# Altium project PPC_notebook_electrical_schematics_v0.6.PrjPcb (part 10 of 10)
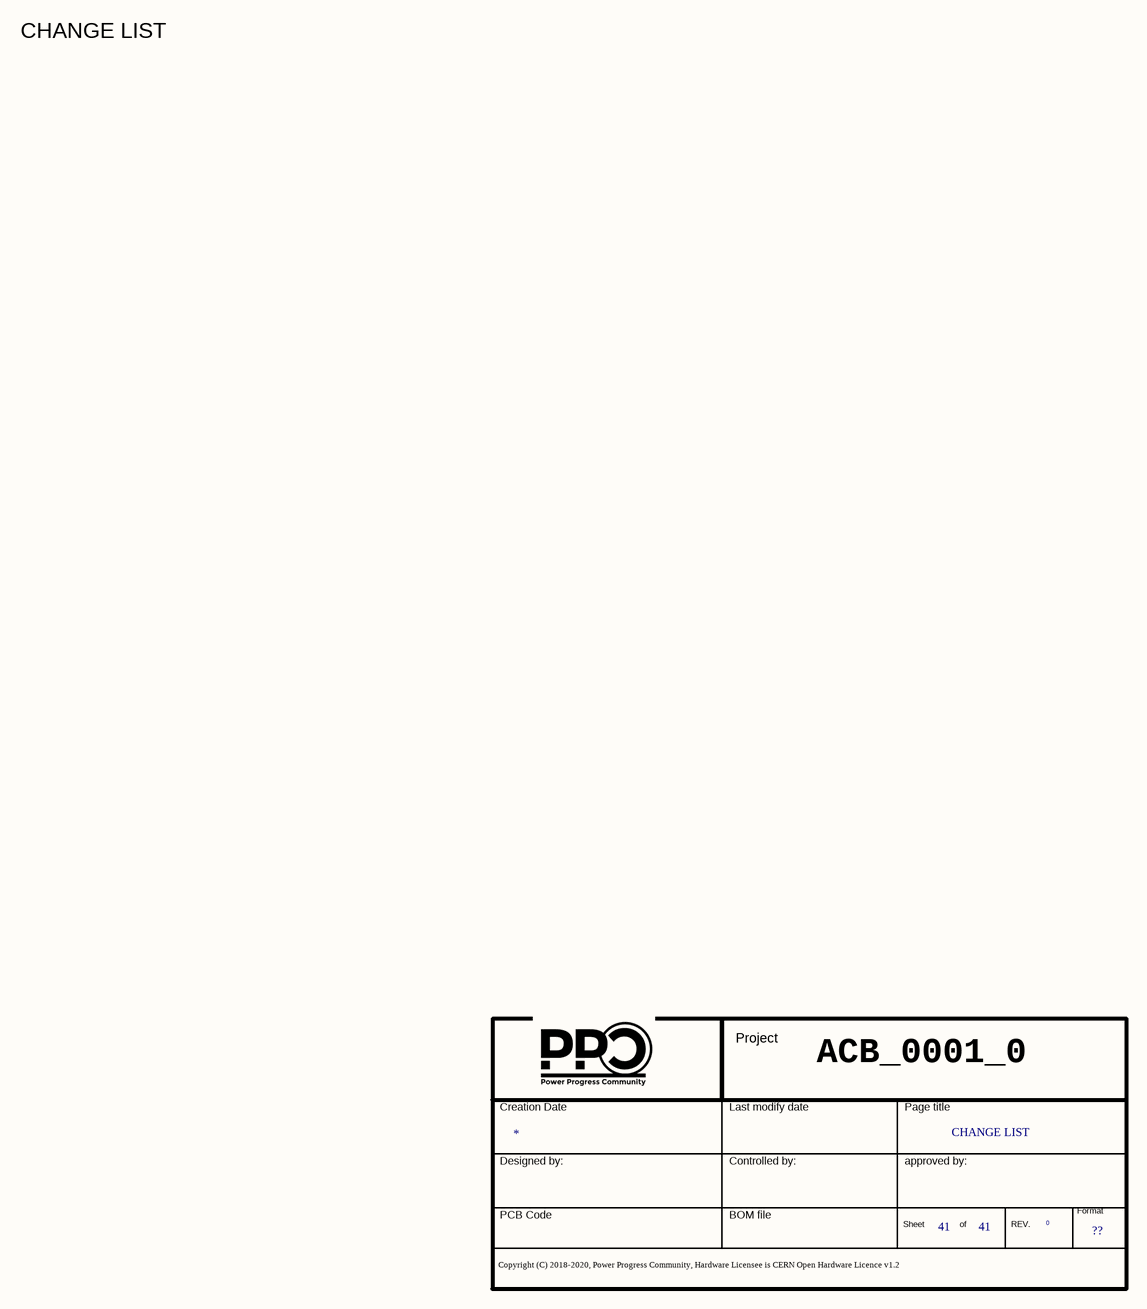
[diagram p68: 33 Change List.SchDoc]

## Nets that join several sheets
1V0: 16 SATA3 CONTROLLER (L23.1), 18B_ETHERNET CARD (J14.25), 29 Other Pwr 1 (R779.2)
1V0_LP: 12 Proc Pwr2 (C384.1 U1.R8), 31 Pwr In (C977.1 J30.1 U79.5)
1V0S: 12 Proc Pwr2 (FL1.1), 30A Other Pwr 2 (5 pins)
1V8: 04 IFC (23 pins), 05 Flash (21 pins), 06 SPI&SDHC (12 pins), 07 SYS (22 pins), 09 USB (C122.1 C123.1 L2.1), 11 Proc Pwr1 (5 pins), 12 Proc Pwr2 (28 pins), 16 SATA3 CONTROLLER (8 pins), 24 AUDIO CMEDIA (L40.1 L41.1), 26 Clock 1 (6 pins), 27 Clock 2 (6 pins), 29 Other Pwr 1 (R797.2), 30A Other Pwr 2 (C933.1 U74.1 U74.2)
1V35: 03B_DDR3_2 (35 pins), 03 DDR3 (37 pins), 11 Proc Pwr1 (R365.1 R366.1 R367.1 R368.1), 12 Proc Pwr2 (50 pins), 29 Other Pwr 1 (R783.2), 30A Other Pwr 2 (C925.1 C926.1 R834.2 U73.2)
2V5: 07 SYS (21 pins), 08 EC&SD (R157.1 R158.1), 10 UART&I2C (5 pins), 12 Proc Pwr2 (11 pins), 29 Other Pwr 1 (C900.1 R801.2)
3V3: 03B_DDR3_2 (C24.1 J3F2.199 J3F2.201), 03 DDR3 (C1.1 J3F1.197 J3F1.199), 05 Flash (C57.1 C58.1 U3.43), 06 SPI&SDHC (10 pins), 07 SYS (31 pins), 08 EC&SD (5 pins), 09A_USB_HUB (16 pins), 09B KEYBOARD (R212.1), 10B_WRAPPER (24 pins), 10 UART&I2C (13 pins), 11 Proc Pwr1 (L10.1), 14 EC1 PHY (L12.1 R386.1), 15_ETHERNET_CONN (7 pins), 16B Sata Connectors (17 pins), 16 SATA3 CONTROLLER (7 pins), 17 USB3 CONTROLLER (22 pins), 18B_ETHERNET CARD (J14.1 J14.2 J14.3), 18 USB3_ports (R452.2 R453.2), 19B WLAN_CONNECTOR (6 pins), 19C_3G_LTE_MODEM (R540.1 R541.1 R542.1 U54.4), 19 PCIE BRIDGE (21 pins), 20 PCIE BRIDGE POWER (39 pins), 21 MXM_PCIe (R573.2 R574.2 R575.2), 22 MXM_VIDEO_OUT (9 pins), 24 AUDIO CMEDIA (L36.1 L37.1 L38.1), 29 Other Pwr 1 (8 pins), 30A Other Pwr 2 (6 pins), 31 Pwr In (6 pins)
5V: 09A_USB_HUB (R195.1), 09B KEYBOARD (R215.1), 09C_KB_LED_AND_LED (R231.1 R238.1 R240.1 R241.1), 16B Sata Connectors (7 pins), 18B_ETHERNET CARD (5 pins), 18 USB3_ports (6 pins), 19B WLAN_CONNECTOR (C595.1 C596.2 U52.2), 22 MXM_VIDEO_OUT (5 pins)
5V0: 21 MXM_PCIe (R566.2 R567.2 R581.2), 24 AUDIO CMEDIA (L39.1), 29 Other Pwr 1 (R816.2)
12V: 21 MXM_PCIe (R561.2 R562.2 R563.2), 24 AUDIO CMEDIA (C757.1 C758.1 L32.1 U60.7), 28 Core Pwr (16 pins), 29 Other Pwr 1 (30 pins), 30A Other Pwr 2 (C937.1 R840.1 U75.2), 30B Main Power (R846.2 R847.1 R848.1 R849.1), 31 Pwr In (FUSE1.2 R878.1)
AGND: 24 AUDIO CMEDIA (12 pins), 25 AUDIO_CONN (34 pins)
DVCC: 24 AUDIO CMEDIA (16 pins), 25 AUDIO_CONN (R664.1)
GND: 03B_DDR3_2 (75 pins), 03 DDR3 (77 pins), 04 IFC (36 pins), 05 Flash (17 pins), 06 SPI&SDHC (20 pins), 07 SYS (26 pins), 08 EC&SD (15 pins), 09A_USB_HUB (26 pins), 09B KEYBOARD (16 pins), 09C_KB_LED_AND_LED (27 pins), 09 USB (10 pins), 10B_WRAPPER (17 pins), 10 UART&I2C (26 pins), 11 Proc Pwr1 (122 pins), 12 Proc Pwr2 (78 pins), 13 Proc Gnd (321 pins), 14 EC1 PHY (51 pins), 15_ETHERNET_CONN (7 pins), 16B Sata Connectors (29 pins), 16 SATA3 CONTROLLER (64 pins), 17 USB3 CONTROLLER (46 pins), 18B_ETHERNET CARD (6 pins), 18 USB3_ports (17 pins), 19B WLAN_CONNECTOR (24 pins), 19C_3G_LTE_MODEM (30 pins), 19 PCIE BRIDGE (35 pins), 20 PCIE BRIDGE POWER (126 pins), 21 MXM_PCIe (93 pins), 22 MXM_VIDEO_OUT (40 pins), 24 AUDIO CMEDIA (C756.1 C757.2 L33.2 R653.1), 26 Clock 1 (12 pins), 27 Clock 2 (33 pins), 28 Core Pwr (29 pins), 29 Other Pwr 1 (50 pins), 30A Other Pwr 2 (26 pins), 30B Main Power (63 pins), 30C_battery_Charger (39 pins), 31 Pwr In (25 pins)
MVREF: 03B_DDR3_2 (C30.1 C31.1 J3F2.1 J3F2.126), 03 DDR3 (6 pins), 30A Other Pwr 2 (C928.1 U73.6)
SVDD: 08 EC&SD (R146.1 R166.1), 12 Proc Pwr2 (26 pins)
VBAT: 10 UART&I2C (BTH1.1 C166.1 R260.1), 31 Pwr In (R876.1)
VCORE: 11 Proc Pwr1 (143 pins), 12 Proc Pwr2 (R379.1), 28 Core Pwr (R743.2)
VIN: 30C_battery_Charger (8 pins), 31 Pwr In (C982.1 R884.2 U81.8)
VOUT: 30B Main Power (R843.1 R844.1 R845.1), 30C_battery_Charger (11 pins)
VTT: 03B_DDR3_2 (5 pins), 03 DDR3 (5 pins), 30A Other Pwr 2 (C930.1 C931.1 R835.2 U73.3)
XVDD: 08 EC&SD (R147.1 R165.1), 12 Proc Pwr2 (28 pins)
ACP: 09B KEYBOARD (Q1.1), 30C_battery_Charger (Q16.1 TP128.1 U77.10)
CHGEN: 09B KEYBOARD (Q2.1), 30C_battery_Charger (Q15.1 TP132.1 U77.6)
CLKREQ_L2: 19C_3G_LTE_MODEM (J16.52), 19 PCIE BRIDGE (R521.1 U50.C13)
CLKREQ_L5: 19B WLAN_CONNECTOR (J15.53), 19 PCIE BRIDGE (R527.1 U50.C12)
CLKREQ_L6: 18B_ETHERNET CARD (J14.13), 19 PCIE BRIDGE (R526.1 U50.C11)
DDR_DQ0: 03B_DDR3_2 (J3F2.5), 03 DDR3 (J3F1.5 U1.B24)
DDR_DQ1: 03B_DDR3_2 (J3F2.7), 03 DDR3 (J3F1.7 U1.A24)
DDR_DQ2: 03B_DDR3_2 (J3F2.15), 03 DDR3 (J3F1.15 U1.C25)
DDR_DQ3: 03B_DDR3_2 (J3F2.17), 03 DDR3 (J3F1.17 U1.D24)
DDR_DQ4: 03B_DDR3_2 (J3F2.4), 03 DDR3 (J3F1.4 U1.D25)
DDR_DQ5: 03B_DDR3_2 (J3F2.6), 03 DDR3 (J3F1.6 U1.C26)
DDR_DQ6: 03B_DDR3_2 (J3F2.16), 03 DDR3 (J3F1.16 U1.B27)
DDR_DQ7: 03B_DDR3_2 (J3F2.18), 03 DDR3 (J3F1.18 U1.C27)
DDR_DQ8: 03B_DDR3_2 (J3F2.21), 03 DDR3 (J3F1.21 U1.H23)
DDR_DQ9: 03B_DDR3_2 (J3F2.23), 03 DDR3 (J3F1.23 U1.G23)
DDR_DQ10: 03B_DDR3_2 (J3F2.33), 03 DDR3 (J3F1.33 U1.F24)
DDR_DQ11: 03B_DDR3_2 (J3F2.35), 03 DDR3 (J3F1.35 U1.F25)
DDR_DQ12: 03B_DDR3_2 (J3F2.22), 03 DDR3 (J3F1.22 U1.E25)
DDR_DQ13: 03B_DDR3_2 (J3F2.24), 03 DDR3 (J3F1.24 U1.E26)
DDR_DQ14: 03B_DDR3_2 (J3F2.34), 03 DDR3 (J3F1.34 U1.D27)
DDR_DQ15: 03B_DDR3_2 (J3F2.36), 03 DDR3 (J3F1.36 U1.G25)
DDR_DQ16: 03B_DDR3_2 (J3F2.39), 03 DDR3 (J3F1.39 U1.J23)
DDR_DQ17: 03B_DDR3_2 (J3F2.41), 03 DDR3 (J3F1.41 U1.H24)
DDR_DQ18: 03B_DDR3_2 (J3F2.51), 03 DDR3 (J3F1.51 U1.H25)
DDR_DQ19: 03B_DDR3_2 (J3F2.53), 03 DDR3 (J3F1.53 U1.J26)
DDR_DQ20: 03B_DDR3_2 (J3F2.40), 03 DDR3 (J3F1.40 U1.J25)
DDR_DQ21: 03B_DDR3_2 (J3F2.42), 03 DDR3 (J3F1.42 U1.J27)
DDR_DQ22: 03B_DDR3_2 (J3F2.50), 03 DDR3 (J3F1.50 U1.H28)
DDR_DQ23: 03B_DDR3_2 (J3F2.52), 03 DDR3 (J3F1.52 U1.K28)
DDR_DQ24: 03B_DDR3_2 (J3F2.57), 03 DDR3 (J3F1.57 U1.L23)
DDR_DQ25: 03B_DDR3_2 (J3F2.59), 03 DDR3 (J3F1.59 U1.M25)
DDR_DQ26: 03B_DDR3_2 (J3F2.67), 03 DDR3 (J3F1.67 U1.K24)
DDR_DQ27: 03B_DDR3_2 (J3F2.69), 03 DDR3 (J3F1.69 U1.K27)
DDR_DQ28: 03B_DDR3_2 (J3F2.56), 03 DDR3 (J3F1.56 U1.M24)
DDR_DQ29: 03B_DDR3_2 (J3F2.58), 03 DDR3 (J3F1.58 U1.L27)
DDR_DQ30: 03B_DDR3_2 (J3F2.68), 03 DDR3 (J3F1.68 U1.M27)
DDR_DQ31: 03B_DDR3_2 (J3F2.70), 03 DDR3 (J3F1.70 U1.M28)
DDR_DQ32: 03B_DDR3_2 (J3F2.129), 03 DDR3 (J3F1.129 U1.T27)
DDR_DQ33: 03B_DDR3_2 (J3F2.131), 03 DDR3 (J3F1.131 U1.V27)
DDR_DQ34: 03B_DDR3_2 (J3F2.141), 03 DDR3 (J3F1.141 U1.U25)
DDR_DQ35: 03B_DDR3_2 (J3F2.143), 03 DDR3 (J3F1.143 U1.U26)
DDR_DQ36: 03B_DDR3_2 (J3F2.130), 03 DDR3 (J3F1.130 U1.R25)
DDR_DQ37: 03B_DDR3_2 (J3F2.132), 03 DDR3 (J3F1.132 U1.T25)
DDR_DQ38: 03B_DDR3_2 (J3F2.140), 03 DDR3 (J3F1.140 U1.T24)
DDR_DQ39: 03B_DDR3_2 (J3F2.142), 03 DDR3 (J3F1.142 U1.U23)
DDR_DQ40: 03B_DDR3_2 (J3F2.147), 03 DDR3 (J3F1.147 U1.Y28)
DDR_DQ41: 03B_DDR3_2 (J3F2.149), 03 DDR3 (J3F1.149 U1.Y27)
DDR_DQ42: 03B_DDR3_2 (J3F2.157), 03 DDR3 (J3F1.157 U1.Y25)
DDR_DQ43: 03B_DDR3_2 (J3F2.159), 03 DDR3 (J3F1.159 U1.Y24)
DDR_DQ44: 03B_DDR3_2 (J3F2.146), 03 DDR3 (J3F1.146 U1.V25)
DDR_DQ45: 03B_DDR3_2 (J3F2.148), 03 DDR3 (J3F1.148 U1.Y23)
DDR_DQ46: 03B_DDR3_2 (J3F2.158), 03 DDR3 (J3F1.158 U1.V24)
DDR_DQ47: 03B_DDR3_2 (J3F2.160), 03 DDR3 (J3F1.160 U1.W23)
DDR_DQ48: 03B_DDR3_2 (J3F2.163), 03 DDR3 (J3F1.163 U1.AA27)
DDR_DQ49: 03B_DDR3_2 (J3F2.165), 03 DDR3 (J3F1.165 U1.AB28)
DDR_DQ50: 03B_DDR3_2 (J3F2.175), 03 DDR3 (J3F1.175 U1.AB27)
DDR_DQ51: 03B_DDR3_2 (J3F2.177), 03 DDR3 (J3F1.177 U1.AC27)
DDR_DQ52: 03B_DDR3_2 (J3F2.164), 03 DDR3 (J3F1.164 U1.AB24)
DDR_DQ53: 03B_DDR3_2 (J3F2.166), 03 DDR3 (J3F1.166 U1.AB23)
DDR_DQ54: 03B_DDR3_2 (J3F2.174), 03 DDR3 (J3F1.174 U1.AA23)
DDR_DQ55: 03B_DDR3_2 (J3F2.176), 03 DDR3 (J3F1.176 U1.AA25)
DDR_DQ56: 03B_DDR3_2 (J3F2.181), 03 DDR3 (J3F1.181 U1.AD28)
DDR_DQ57: 03B_DDR3_2 (J3F2.183), 03 DDR3 (J3F1.183 U1.AD27)
DDR_DQ58: 03B_DDR3_2 (J3F2.191), 03 DDR3 (J3F1.191 U1.AE27)
DDR_DQ59: 03B_DDR3_2 (J3F2.193), 03 DDR3 (J3F1.193 U1.AC25)
DDR_DQ60: 03B_DDR3_2 (J3F2.180), 03 DDR3 (J3F1.180 U1.AF28)
DDR_DQ61: 03B_DDR3_2 (J3F2.182), 03 DDR3 (J3F1.182 U1.AF27)
DDR_DQ62: 03B_DDR3_2 (J3F2.192), 03 DDR3 (J3F1.192 U1.AG27)
DDR_DQ63: 03B_DDR3_2 (J3F2.194), 03 DDR3 (J3F1.194 U1.AE26)
DDR_MA0: 03B_DDR3_2 (J3F2.98), 03 DDR3 (J3F1.98 U1.Y30)
DDR_MA1: 03B_DDR3_2 (J3F2.97), 03 DDR3 (J3F1.97 U1.W29)
DDR_MA2: 03B_DDR3_2 (J3F2.96), 03 DDR3 (J3F1.96 U1.M30)
DDR_MA3: 03B_DDR3_2 (J3F2.95), 03 DDR3 (J3F1.95 U1.L30)
DDR_MA4: 03B_DDR3_2 (J3F2.92), 03 DDR3 (J3F1.92 U1.L29)
DDR_MA5: 03B_DDR3_2 (J3F2.91), 03 DDR3 (J3F1.91 U1.J30)
DDR_MA6: 03B_DDR3_2 (J3F2.90), 03 DDR3 (J3F1.90 U1.J29)
DDR_MA7: 03B_DDR3_2 (J3F2.86), 03 DDR3 (J3F1.86 U1.G29)
DDR_MA8: 03B_DDR3_2 (J3F2.89), 03 DDR3 (J3F1.89 U1.H30)
DDR_MA9: 03B_DDR3_2 (J3F2.85), 03 DDR3 (J3F1.85 U1.F30)
DDR_MA10: 03B_DDR3_2 (J3F2.107), 03 DDR3 (J3F1.107 U1.AB30)
DDR_MA11: 03B_DDR3_2 (J3F2.84), 03 DDR3 (J3F1.84 U1.G30)
DDR_MA12: 03B_DDR3_2 (J3F2.83), 03 DDR3 (J3F1.83 U1.E29)
DDR_MA13: 03B_DDR3_2 (J3F2.119), 03 DDR3 (J3F1.119 U1.AG29)
DDR_MA14: 03B_DDR3_2 (J3F2.80), 03 DDR3 (J3F1.80 U1.D30)
DDR_MA15: 03B_DDR3_2 (J3F2.78), 03 DDR3 (J3F1.78 U1.C29)
DDR_MBA0: 03B_DDR3_2 (J3F2.109), 03 DDR3 (J3F1.109 U1.AC30)
DDR_MBA1: 03B_DDR3_2 (J3F2.108), 03 DDR3 (J3F1.108 U1.AA29)
DDR_MBA2: 03B_DDR3_2 (J3F2.79), 03 DDR3 (J3F1.79 U1.D28)
DDR_MCK2_N: 03B_DDR3_2 (J3F2.103), 03 DDR3 (U1.U30)
DDR_MCK2_P: 03B_DDR3_2 (J3F2.101), 03 DDR3 (U1.U29)
DDR_MCK3_N: 03B_DDR3_2 (J3F2.104), 03 DDR3 (U1.V30)
DDR_MCK3_P: 03B_DDR3_2 (J3F2.102), 03 DDR3 (U1.W30)
DDR_MCKE2: 03B_DDR3_2 (J3F2.73), 03 DDR3 (U1.C30)
DDR_MCKE3: 03B_DDR3_2 (J3F2.74), 03 DDR3 (U1.A28)
DDR_MCRAS_N: 03B_DDR3_2 (J3F2.115), 03 DDR3 (J3F1.115 U1.AE29)
DDR_MCS2_N: 03B_DDR3_2 (J3F2.114), 03 DDR3 (U1.AK28)
DDR_MCS3_N: 03B_DDR3_2 (J3F2.121), 03 DDR3 (U1.AJ28)
DDR_MDM0: 03B_DDR3_2 (J3F2.11), 03 DDR3 (J3F1.11 U1.A25)
DDR_MDM1: 03B_DDR3_2 (J3F2.28), 03 DDR3 (J3F1.28 U1.E27)
DDR_MDM2: 03B_DDR3_2 (J3F2.46), 03 DDR3 (J3F1.46 U1.G26)
DDR_MDM3: 03B_DDR3_2 (J3F2.63), 03 DDR3 (J3F1.63 U1.K25)
DDR_MDM4: 03B_DDR3_2 (J3F2.136), 03 DDR3 (J3F1.136 U1.T28)
DDR_MDM5: 03B_DDR3_2 (J3F2.153), 03 DDR3 (J3F1.153 U1.W25)
DDR_MDM6: 03B_DDR3_2 (J3F2.170), 03 DDR3 (J3F1.170 U1.AA26)
DDR_MDM7: 03B_DDR3_2 (J3F2.187), 03 DDR3 (J3F1.187 U1.AJ27)
DDR_MDQS0_N: 03B_DDR3_2 (J3F2.10), 03 DDR3 (J3F1.10 U1.B25)
DDR_MDQS0_P: 03B_DDR3_2 (J3F2.12), 03 DDR3 (J3F1.12 U1.A26)
DDR_MDQS1_N: 03B_DDR3_2 (J3F2.27), 03 DDR3 (J3F1.27 U1.F27)
DDR_MDQS1_P: 03B_DDR3_2 (J3F2.29), 03 DDR3 (J3F1.29 U1.F28)
DDR_MDQS2_N: 03B_DDR3_2 (J3F2.45), 03 DDR3 (J3F1.45 U1.H27)
DDR_MDQS2_P: 03B_DDR3_2 (J3F2.47), 03 DDR3 (J3F1.47 U1.G27)
DDR_MDQS3_N: 03B_DDR3_2 (J3F2.62), 03 DDR3 (J3F1.62 U1.L25)
DDR_MDQS3_P: 03B_DDR3_2 (J3F2.64), 03 DDR3 (J3F1.64 U1.L26)
DDR_MDQS4_N: 03B_DDR3_2 (J3F2.135), 03 DDR3 (J3F1.135 U1.U27)
DDR_MDQS4_P: 03B_DDR3_2 (J3F2.137), 03 DDR3 (J3F1.137 U1.V28)
DDR_MDQS5_N: 03B_DDR3_2 (J3F2.152), 03 DDR3 (J3F1.152 U1.W26)
DDR_MDQS5_P: 03B_DDR3_2 (J3F2.154), 03 DDR3 (J3F1.154 U1.W27)
DDR_MDQS6_N: 03B_DDR3_2 (J3F2.169), 03 DDR3 (J3F1.169 U1.AC26)
DDR_MDQS6_P: 03B_DDR3_2 (J3F2.171), 03 DDR3 (J3F1.171 U1.AB25)
DDR_MDQS7_N: 03B_DDR3_2 (J3F2.186), 03 DDR3 (J3F1.186 U1.AH27)
DDR_MDQS7_P: 03B_DDR3_2 (J3F2.188), 03 DDR3 (J3F1.188 U1.AH26)
DDR_MODT2: 03B_DDR3_2 (J3F2.116), 03 DDR3 (U1.AF30)
DDR_MODT3: 03B_DDR3_2 (J3F2.120), 03 DDR3 (U1.AJ29)
DDR_MRAS_N: 03B_DDR3_2 (J3F2.110), 03 DDR3 (J3F1.110 U1.AC29)
DDR_MWE_N: 03B_DDR3_2 (J3F2.113), 03 DDR3 (J3F1.113 U1.AE30)
DWNRST1_L: 18B_ETHERNET CARD (R456.1), 19 PCIE BRIDGE (R490.1 U50.P14)
DWNRST2_L: 19C_3G_LTE_MODEM (J16.50), 19 PCIE BRIDGE (R488.1 U50.P13)
DWNRST3_L: 17 USB3 CONTROLLER (R445.1), 19 PCIE BRIDGE (R486.1 U50.N14)
DWNRST4_L: 19 PCIE BRIDGE (R484.1 U50.N13), 24 AUDIO CMEDIA (U61.28)
DWNRST5_L: 19B WLAN_CONNECTOR (R534.1), 19 PCIE BRIDGE (R482.1 U50.M14)
EXP_SCL: 10B_WRAPPER (R304.1 R348.1), 23 I2C WRAP (R625.2)
EXP_SDA: 10B_WRAPPER (R303.1 R345.1), 23 I2C WRAP (R626.2)
HUB_USB1_DN: 09A_USB_HUB (U23.1), 09B KEYBOARD (R222.2)
HUB_USB1_DP: 09A_USB_HUB (U23.2), 09B KEYBOARD (R220.2)
HUB_USB2_DN: 09A_USB_HUB (U23.3), 19B WLAN_CONNECTOR (J15.5)
HUB_USB2_DP: 09A_USB_HUB (U23.4), 19B WLAN_CONNECTOR (J15.3)
L4_RXN: 19C_3G_LTE_MODEM (C604.1), 19 PCIE BRIDGE (U50.B12)
L4_RXP: 19C_3G_LTE_MODEM (C603.1), 19 PCIE BRIDGE (U50.A12)
L4_TXN: 19C_3G_LTE_MODEM (J16.47), 19 PCIE BRIDGE (C579.2)
L4_TXP: 19C_3G_LTE_MODEM (J16.49), 19 PCIE BRIDGE (C577.2)
L5_RXN: 19C_3G_LTE_MODEM (C607.1), 19 PCIE BRIDGE (U50.B10)
L5_RXP: 19C_3G_LTE_MODEM (C606.1), 19 PCIE BRIDGE (U50.A10)
L5_TXN: 19C_3G_LTE_MODEM (J16.35), 19 PCIE BRIDGE (C578.2)
L5_TXP: 19C_3G_LTE_MODEM (J16.37), 19 PCIE BRIDGE (C576.2)
NetC84_2: 08 EC&SD (C84.2), 19 PCIE BRIDGE (U50.P3)
NetC85_2: 08 EC&SD (C85.2), 19 PCIE BRIDGE (U50.N3)
NetC86_2: 08 EC&SD (C86.2), 19 PCIE BRIDGE (U50.P5)
NetC87_2: 08 EC&SD (C87.2), 19 PCIE BRIDGE (U50.N5)
NetC88_2: 08 EC&SD (C88.2), 19 PCIE BRIDGE (U50.P10)
NetC89_2: 08 EC&SD (C89.2), 19 PCIE BRIDGE (U50.N10)
NetC90_2: 08 EC&SD (C90.2), 19 PCIE BRIDGE (U50.P12)
NetC92_2: 08 EC&SD (C92.2), 19 PCIE BRIDGE (U50.N12)
NetC93_2: 08 EC&SD (C93.2), 21 MXM_PCIe (J18.149)
NetC94_2: 08 EC&SD (C94.2), 21 MXM_PCIe (J18.147)
NetC95_2: 08 EC&SD (C95.2), 21 MXM_PCIe (J18.143)
NetC96_2: 08 EC&SD (C96.2), 21 MXM_PCIe (J18.141)
NetC97_2: 08 EC&SD (C97.2), 21 MXM_PCIe (J18.137)
NetC98_2: 08 EC&SD (C98.2), 21 MXM_PCIe (J18.135)
NetC99_2: 08 EC&SD (C99.2), 21 MXM_PCIe (J18.123)
NetC100_2: 08 EC&SD (C100.2), 21 MXM_PCIe (J18.121)
NetC101_2: 08 EC&SD (C101.2), 16B Sata Connectors (R433.1)
NetC102_2: 08 EC&SD (C102.2), 16B Sata Connectors (R434.1)
NetC103_2: 08 EC&SD (C103.2), 16B Sata Connectors (J13.31)
NetC104_2: 08 EC&SD (C104.2), 16B Sata Connectors (J13.29)
NetC105_2: 08 EC&SD (C105.2), 16B Sata Connectors (J13.19)
NetC106_2: 08 EC&SD (C106.2), 16B Sata Connectors (J13.17)
NetC107_2: 08 EC&SD (C107.2), 16B Sata Connectors (J13.7)
NetC108_2: 08 EC&SD (C108.2), 16B Sata Connectors (J13.5)
NetC109_2: 08 EC&SD (C109.2), 16 SATA3 CONTROLLER (C424.2)
NetC110_2: 08 EC&SD (C110.2), 16 SATA3 CONTROLLER (C425.2)
NetC111_2: 08 EC&SD (C111.2), 16 SATA3 CONTROLLER (C426.2)
NetC112_2: 08 EC&SD (C112.2), 16 SATA3 CONTROLLER (C427.2)
NetC113_1: 08 EC&SD (C113.1), 27 Clock 2 (R710.2 R713.2)
NetC114_1: 08 EC&SD (C114.1), 27 Clock 2 (R708.2 R709.2)
NetC500_1: 08 EC&SD (U1.AA3), 16B Sata Connectors (C500.1)
NetC501_1: 08 EC&SD (U1.AA4), 16B Sata Connectors (C501.1)
NetC509_1: 08 EC&SD (U1.AC4), 16B Sata Connectors (C509.1)
NetC510_1: 08 EC&SD (U1.AC3), 16B Sata Connectors (C510.1)
NetC511_1: 08 EC&SD (U1.AD1), 16B Sata Connectors (C511.1)
NetC512_1: 08 EC&SD (U1.AD2), 16B Sata Connectors (C512.1)
NetC513_1: 08 EC&SD (U1.AK3), 16B Sata Connectors (C513.1)
NetC514_1: 08 EC&SD (U1.AJ3), 16B Sata Connectors (C514.1)
NetC556_2: 17 USB3 CONTROLLER (C556.2), 18 USB3_ports (FL3.1)
NetC557_2: 17 USB3 CONTROLLER (C557.2), 18 USB3_ports (FL3.4)
NetC560_2: 17 USB3 CONTROLLER (C560.2), 18 USB3_ports (FL6.1)
NetC561_2: 17 USB3 CONTROLLER (C561.2), 18 USB3_ports (FL6.4)
NetC568_2: 18B_ETHERNET CARD (J14.14), 19 PCIE BRIDGE (C568.2)
NetC570_2: 18B_ETHERNET CARD (J14.15), 19 PCIE BRIDGE (C570.2)
NetC580_2: 08 EC&SD (U1.AH17), 19 PCIE BRIDGE (C580.2)
NetC581_2: 08 EC&SD (U1.AJ17), 19 PCIE BRIDGE (C581.2)
NetC582_2: 08 EC&SD (U1.AH18), 19 PCIE BRIDGE (C582.2)
NetC583_2: 08 EC&SD (U1.AK17), 19 PCIE BRIDGE (C583.2)
NetC584_2: 08 EC&SD (U1.AK13), 19 PCIE BRIDGE (C584.2)
NetC585_2: 08 EC&SD (U1.AH12), 19 PCIE BRIDGE (C585.2)
NetC586_2: 08 EC&SD (U1.AJ13), 19 PCIE BRIDGE (C586.2)
NetC587_2: 08 EC&SD (U1.AH13), 19 PCIE BRIDGE (C587.2)
NetC703_1: 08 EC&SD (U1.AH24), 21 MXM_PCIe (C703.1)
NetC704_1: 08 EC&SD (U1.AH23), 21 MXM_PCIe (C704.1)
NetC705_1: 08 EC&SD (U1.AK23), 21 MXM_PCIe (C705.1)
NetC706_1: 08 EC&SD (U1.AJ23), 21 MXM_PCIe (C706.1)
NetC707_1: 08 EC&SD (U1.AH20), 21 MXM_PCIe (C707.1)
NetC708_1: 08 EC&SD (U1.AH21), 21 MXM_PCIe (C708.1)
NetC709_1: 08 EC&SD (U1.AK20), 21 MXM_PCIe (C709.1)
NetC710_1: 08 EC&SD (U1.AJ20), 21 MXM_PCIe (C710.1)
NetC715_2: 21 MXM_PCIe (C715.2), 22 MXM_VIDEO_OUT (J20.24)
NetC716_2: 21 MXM_PCIe (C716.2), 22 MXM_VIDEO_OUT (J20.22)
NetC717_2: 21 MXM_PCIe (C717.2), 22 MXM_VIDEO_OUT (J20.18)
NetC718_2: 21 MXM_PCIe (C718.2), 22 MXM_VIDEO_OUT (J20.16)
NetC719_2: 21 MXM_PCIe (C719.2), 22 MXM_VIDEO_OUT (U57.12)
NetC720_2: 21 MXM_PCIe (C720.2), 22 MXM_VIDEO_OUT (U57.10)
NetC721_2: 21 MXM_PCIe (C721.2), 22 MXM_VIDEO_OUT (J20.12)
NetC722_2: 21 MXM_PCIe (C722.2), 22 MXM_VIDEO_OUT (J20.10)
NetC723_2: 21 MXM_PCIe (C723.2), 22 MXM_VIDEO_OUT (U57.9)
NetC724_2: 21 MXM_PCIe (C724.2), 22 MXM_VIDEO_OUT (U57.7)
NetC725_2: 21 MXM_PCIe (C725.2), 22 MXM_VIDEO_OUT (J20.6)
NetC726_2: 21 MXM_PCIe (C726.2), 22 MXM_VIDEO_OUT (J20.4)
NetC727_2: 21 MXM_PCIe (C727.2), 22 MXM_VIDEO_OUT (U57.6)
NetC728_2: 21 MXM_PCIe (C728.2), 22 MXM_VIDEO_OUT (U57.4)
NetC729_2: 21 MXM_PCIe (C729.2), 22 MXM_VIDEO_OUT (J20.30)
NetC730_2: 21 MXM_PCIe (C730.2), 22 MXM_VIDEO_OUT (J20.28)
NetC731_2: 21 MXM_PCIe (C731.2), 22 MXM_VIDEO_OUT (U57.15)
NetC732_2: 21 MXM_PCIe (C732.2), 22 MXM_VIDEO_OUT (U57.13)
NetC734_1: 21 MXM_PCIe (J18.276), 22 MXM_VIDEO_OUT (C734.1 R595.2 U57.19)
NetC751_1: 24 AUDIO CMEDIA (C751.1 R636.1 R639.2 R642.2), 25 AUDIO_CONN (8 pins)
NetC782_1: 24 AUDIO CMEDIA (U58.16), 25 AUDIO_CONN (C782.1)
NetC783_1: 24 AUDIO CMEDIA (R648.1), 25 AUDIO_CONN (C783.1)
NetC784_1: 24 AUDIO CMEDIA (U58.17), 25 AUDIO_CONN (C784.1)
NetC785_1: 24 AUDIO CMEDIA (R649.1), 25 AUDIO_CONN (C785.1)
NetC792_1: 24 AUDIO CMEDIA (U58.22), 25 AUDIO_CONN (C792.1)
NetC793_1: 24 AUDIO CMEDIA (U58.21), 25 AUDIO_CONN (C793.1)
NetC796_1: 24 AUDIO CMEDIA (U58.36), 25 AUDIO_CONN (C796.1)
NetC797_1: 24 AUDIO CMEDIA (U58.35), 25 AUDIO_CONN (C797.1)
NetC798_1: 24 AUDIO CMEDIA (U58.15), 25 AUDIO_CONN (C798.1)
NetC799_1: 24 AUDIO CMEDIA (U58.14), 25 AUDIO_CONN (C799.1)
NetD6_3: 10B_WRAPPER (R334.2), 14 EC1 PHY (D6.3)
NetD25_CATHODE: 10 UART&I2C (R262.1 U31.8), 31 Pwr In (D25.CATHODE)
NetFL4_1: 17 USB3 CONTROLLER (U44.51), 18 USB3_ports (FL4.1)
NetFL4_4: 17 USB3 CONTROLLER (U44.50), 18 USB3_ports (FL4.4)
NetFL5_1: 17 USB3 CONTROLLER (U44.47), 18 USB3_ports (FL5.1)
NetFL5_4: 17 USB3 CONTROLLER (U44.48), 18 USB3_ports (FL5.4)
NetFL7_1: 17 USB3 CONTROLLER (U44.42), 18 USB3_ports (FL7.1)
NetFL7_4: 17 USB3 CONTROLLER (U44.41), 18 USB3_ports (FL7.4)
NetFL8_1: 17 USB3 CONTROLLER (U44.38), 18 USB3_ports (FL8.1)
NetFL8_4: 17 USB3 CONTROLLER (U44.39), 18 USB3_ports (FL8.4)
NetFL9_1: 17 USB3 CONTROLLER (U44.68), 18B_ETHERNET CARD (FL9.1)
NetFL9_4: 17 USB3 CONTROLLER (U44.67), 18B_ETHERNET CARD (FL9.4)
NetFL10_1: 09A_USB_HUB (U23.8), 18B_ETHERNET CARD (FL10.1)
NetFL10_4: 09A_USB_HUB (U23.9), 18B_ETHERNET CARD (FL10.4)
NetFL11_1: 17 USB3 CONTROLLER (U44.59), 18B_ETHERNET CARD (FL11.1)
NetFL11_4: 17 USB3 CONTROLLER (U44.58), 18B_ETHERNET CARD (FL11.4)
NetFL12_1: 09A_USB_HUB (U23.6), 19C_3G_LTE_MODEM (FL12.1)
NetFL12_4: 09A_USB_HUB (U23.7), 19C_3G_LTE_MODEM (FL12.4)
NetJ3F1_30: 03B_DDR3_2 (J3F2.30 R5.2), 03 DDR3 (J3F1.30 R2.2), 10B_WRAPPER (R281.2)
NetJ3F1_200: 03 DDR3 (J3F1.200), 23 I2C WRAP (R630.2)
NetJ3F1_202: 03 DDR3 (J3F1.202), 23 I2C WRAP (R629.2)
NetJ3F2_200: 03B_DDR3_2 (J3F2.200), 23 I2C WRAP (R628.2)
NetJ3F2_202: 03B_DDR3_2 (J3F2.202), 23 I2C WRAP (R627.2)
NetJ13_53: 16B Sata Connectors (J13.53), 27 Clock 2 (R727.2 R728.1)
NetJ13_55: 16B Sata Connectors (J13.55), 27 Clock 2 (R723.1 R726.2)
NetJ14_17: 18B_ETHERNET CARD (J14.17), 19 PCIE BRIDGE (U50.M1)
NetJ14_18: 18B_ETHERNET CARD (J14.18), 19 PCIE BRIDGE (U50.M2)
NetJ14_20: 18B_ETHERNET CARD (J14.20), 19 PCIE BRIDGE (R469.1 R489.2)
NetJ14_21: 18B_ETHERNET CARD (J14.21), 19 PCIE BRIDGE (R470.1 R487.2)
NetJ15_22: 10 UART&I2C (R246.1), 19B WLAN_CONNECTOR (J15.22)
NetJ15_32: 10 UART&I2C (R250.1), 19B WLAN_CONNECTOR (J15.32)
NetJ15_34: 10 UART&I2C (R242.1), 19B WLAN_CONNECTOR (J15.34)
NetJ15_36: 10 UART&I2C (R243.1), 19B WLAN_CONNECTOR (J15.36)
NetJ15_47: 19B WLAN_CONNECTOR (J15.47), 19 PCIE BRIDGE (R467.1 R485.2)
NetJ15_49: 19B WLAN_CONNECTOR (J15.49), 19 PCIE BRIDGE (R468.1 R483.2)
NetJ15_54: 10B_WRAPPER (R347.2), 19B WLAN_CONNECTOR (J15.54 R529.2)
NetJ15_56: 10B_WRAPPER (R349.2), 19B WLAN_CONNECTOR (J15.56 R528.2)
NetJ16_53: 19C_3G_LTE_MODEM (J16.53), 19 PCIE BRIDGE (R462.1 R476.2)
NetJ16_55: 19C_3G_LTE_MODEM (J16.55), 19 PCIE BRIDGE (R461.1 R477.2)
NetJ18_29: 21 MXM_PCIe (J18.29), 22 MXM_VIDEO_OUT (R596.2 U57.16)
NetJ18_153: 21 MXM_PCIe (J18.153), 27 Clock 2 (R721.2 R724.2)
NetJ18_155: 21 MXM_PCIe (J18.155), 27 Clock 2 (R718.2 R719.2)
NetJ18_274: 21 MXM_PCIe (J18.274), 22 MXM_VIDEO_OUT (R610.1)
NetJ18_277: 21 MXM_PCIe (J18.277), 22 MXM_VIDEO_OUT (U57.18)
NetJ18_279: 21 MXM_PCIe (J18.279), 22 MXM_VIDEO_OUT (U57.17)
NetJ20_17: 10B_WRAPPER (R329.2), 22 MXM_VIDEO_OUT (J20.17)
NetJ20_19: 10B_WRAPPER (R352.2), 22 MXM_VIDEO_OUT (J20.19)
NetJ21_6: 24 AUDIO CMEDIA (R638.2), 25 AUDIO_CONN (J21.6)
NetJ30_2: 07 SYS (U1.R7), 31 Pwr In (J30.2)
NetM3_1: 09C_KB_LED_AND_LED (M3.1), 10B_WRAPPER (R322.2)
NetM4_1: 09C_KB_LED_AND_LED (M4.1), 10B_WRAPPER (R331.2)
NetM5_1: 09C_KB_LED_AND_LED (M5.1), 10B_WRAPPER (R324.2)
NetM6_1: 09C_KB_LED_AND_LED (M6.1), 10B_WRAPPER (R328.2)
NetM7_1: 09C_KB_LED_AND_LED (M7.1), 10B_WRAPPER (R314.2)
NetM8_1: 09C_KB_LED_AND_LED (M8.1), 10B_WRAPPER (R315.2)
NetM9_1: 09C_KB_LED_AND_LED (M9.1), 10B_WRAPPER (R316.2)
NetQ21_1: 10B_WRAPPER (R313.2), 31 Pwr In (Q21.1)
NetR30_1: 04 IFC (R30.1 U1.D19), 10B_WRAPPER (U32.98)
NetR31_1: 04 IFC (R31.1 U1.H16), 10B_WRAPPER (U32.96)
NetR32_2: 04 IFC (R32.2 U1.F17), 10B_WRAPPER (U32.97)
NetR38_1: 04 IFC (R38.1 U1.C19), 10B_WRAPPER (U32.94)
NetR39_1: 04 IFC (R39.1 U1.J17), 10B_WRAPPER (U32.91)
NetR49_2: 04 IFC (R49.2), 10B_WRAPPER (U32.95)
NetR50_1: 05 Flash (R50.1 U3.32), 10B_WRAPPER (R282.2)
NetR54_1: 05 Flash (R54.1 U4.9), 10B_WRAPPER (R284.2)
NetR55_1: 05 Flash (R55.1 U3.14), 10B_WRAPPER (R283.2)
NetR56_1: 05 Flash (R56.1 U4.7), 10B_WRAPPER (R295.2)
NetR77_1: 07 SYS (R77.1 U1.D12), 10B_WRAPPER (R310.2)
NetR78_1: 07 SYS (R78.1 U1.F11), 10B_WRAPPER (R308.2)
NetR79_1: 07 SYS (R79.1 U1.F10), 10B_WRAPPER (R307.2)
NetR83_1: 07 SYS (R83.1 U1.G11), 10B_WRAPPER (R280.2)
NetR87_1: 07 SYS (R87.1 U1.P4), 10B_WRAPPER (R343.1)
NetR88_2: 07 SYS (R88.2 U1.P6), 10B_WRAPPER (U32.9)
NetR89_1: 07 SYS (R89.1 U1.P3), 14 EC1 PHY (R383.1)
NetR90_1: 07 SYS (R90.1 U1.P5), 14 EC1 PHY (R384.1)
NetR93_1: 07 SYS (R93.1 U1.D10), 10B_WRAPPER (U32.8)
NetR94_1: 07 SYS (R94.1 U1.E11), 10B_WRAPPER (R270.2)
NetR95_2: 07 SYS (R95.2 U1.H12), 10 UART&I2C (U29.7)
NetR108_1: 07 SYS (R108.1 U17.5), 10 UART&I2C (U29.5 U30.5 U31.9), 23 I2C WRAP (R628.1 R630.1), 27 Clock 2 (U64.10), 28 Core Pwr (R755.2)
NetR109_1: 07 SYS (R109.1 U17.6), 10 UART&I2C (U29.6 U30.6 U31.10), 23 I2C WRAP (R627.1 R629.1), 27 Clock 2 (U64.9), 28 Core Pwr (R754.2)
NetR120_1: 07 SYS (R120.1 U18.5), 23 I2C WRAP (TP98.1)
NetR121_1: 07 SYS (R121.1 U18.6), 23 I2C WRAP (TP97.1)
NetR126_1: 07 SYS (R126.1 U19.5), 23 I2C WRAP (R621.1 R623.1)
NetR127_1: 07 SYS (R127.1 U19.6), 23 I2C WRAP (R622.1 R624.1)
NetR129_2: 07 SYS (R129.2 U20.6), 23 I2C WRAP (R625.1)
NetR130_2: 07 SYS (R130.2 U20.5), 23 I2C WRAP (R626.1)
NetR137_2: 08 EC&SD (R137.2), 14 EC1 PHY (U38.25)
NetR138_2: 08 EC&SD (R138.2), 14 EC1 PHY (U38.24)
NetR139_2: 08 EC&SD (R139.2), 10B_WRAPPER (U32.19)
NetR140_2: 08 EC&SD (R140.2), 10B_WRAPPER (U32.20)
NetR141_2: 08 EC&SD (R141.2), 10B_WRAPPER (U32.21)
NetR142_2: 08 EC&SD (R142.2), 10B_WRAPPER (U32.22)
NetR143_2: 08 EC&SD (R143.2), 10B_WRAPPER (U32.23)
NetR144_2: 08 EC&SD (R144.2), 10B_WRAPPER (U32.27)
NetR145_2: 08 EC&SD (R145.2), 10B_WRAPPER (U32.32)
NetR148_2: 08 EC&SD (R148.2), 10B_WRAPPER (U32.34)
NetR149_2: 08 EC&SD (R149.2), 10B_WRAPPER (U32.43)
NetR150_2: 08 EC&SD (R150.2), 10B_WRAPPER (U32.37)
NetR151_2: 08 EC&SD (R151.2), 10B_WRAPPER (U32.39)
NetR152_2: 08 EC&SD (R152.2), 10B_WRAPPER (U32.38)
NetR153_2: 08 EC&SD (R153.2), 10B_WRAPPER (U32.36)
NetR156_2: 08 EC&SD (R156.2 R158.2), 14 EC1 PHY (R389.1)
NetR157_2: 08 EC&SD (R157.2 U1.N3), 14 EC1 PHY (R388.1)
NetR174_2: 09 USB (R174.2), 10B_WRAPPER (U32.87)
NetR175_2: 09 USB (R175.2), 10B_WRAPPER (U32.86)
NetR176_2: 09 USB (R176.2), 10B_WRAPPER (U32.83)
NetR177_2: 09 USB (R177.2), 10B_WRAPPER (U32.82)
NetR178_2: 09 USB (R178.2), 10B_WRAPPER (U32.79)
NetR179_2: 09 USB (R179.2), 10B_WRAPPER (U32.78)
NetR180_2: 09 USB (R180.2), 10B_WRAPPER (U32.77)
NetR181_2: 09 USB (R181.2), 10B_WRAPPER (U32.76)
NetR216_2: 09B KEYBOARD (R216.2), 10B_WRAPPER (R336.2)
NetR224_2: 09B KEYBOARD (R224.2), 10B_WRAPPER (R325.2)
NetR244_1: 10B_WRAPPER (R350.1), 10 UART&I2C (R244.1)
NetR245_1: 10B_WRAPPER (U32.4), 10 UART&I2C (R245.1)
NetR261_1: 07 SYS (U1.K22), 10 UART&I2C (R261.1)
NetR263_1: 10B_WRAPPER (R319.2), 10 UART&I2C (R263.1 U31.4)
NetR264_1: 07 SYS (U1.J21), 10 UART&I2C (R264.1)
NetR275_1: 07 SYS (U1.K5), 10B_WRAPPER (R275.1)
NetR277_1: 07 SYS (U1.E1), 10B_WRAPPER (R277.1)
NetR285_2: 10B_WRAPPER (R285.2), 16B Sata Connectors (R432.1)
NetR286_2: 10B_WRAPPER (R286.2), 16 SATA3 CONTROLLER (U42.61)
NetR287_2: 10B_WRAPPER (R287.2), 16B Sata Connectors (R436.1)
NetR288_2: 10B_WRAPPER (R288.2), 19 PCIE BRIDGE (U50.M13)
NetR289_2: 10B_WRAPPER (R289.2), 21 MXM_PCIe (R587.1)
NetR290_2: 10B_WRAPPER (R290.2), 19B WLAN_CONNECTOR (R531.2)
NetR291_2: 10B_WRAPPER (R291.2), 19B WLAN_CONNECTOR (R530.2 R532.1)
NetR292_2: 10B_WRAPPER (R292.2), 28 Core Pwr (R738.1), 30A Other Pwr 2 (U74.5)
NetR294_2: 10B_WRAPPER (R294.2), 17 USB3 CONTROLLER (U44.3)
NetR297_2: 10B_WRAPPER (R297.2), 22 MXM_VIDEO_OUT (R614.2)
NetR300_2: 10B_WRAPPER (R300.2), 22 MXM_VIDEO_OUT (R616.2)
NetR301_2: 10B_WRAPPER (R301.2), 21 MXM_PCIe (R564.2 R577.1)
NetR302_2: 10B_WRAPPER (R302.2 R306.2), 21 MXM_PCIe (R578.1)
NetR309_2: 09B KEYBOARD (U24.13), 10B_WRAPPER (R309.2)
NetR311_2: 10B_WRAPPER (R311.2), 21 MXM_PCIe (R572.1)
NetR312_2: 10B_WRAPPER (R312.2), 31 Pwr In (R881.2 U80.2)
NetR317_2: 10B_WRAPPER (R317.2), 21 MXM_PCIe (R586.1)
NetR320_2: 07 SYS (U1.L5), 10B_WRAPPER (R320.2)
NetR330_2: 10B_WRAPPER (R330.2), 21 MXM_PCIe (R580.1)
NetR332_2: 10B_WRAPPER (R332.2), 21 MXM_PCIe (R582.1)
NetR338_2: 10B_WRAPPER (R338.2), 28 Core Pwr (R756.2)
NetR342_2: 10B_WRAPPER (R342.2), 28 Core Pwr (R752.2)
NetR344_2: 10B_WRAPPER (R344.2), 19C_3G_LTE_MODEM (R547.2 R548.1)
NetR351_2: 10B_WRAPPER (R351.2), 19C_3G_LTE_MODEM (R546.2)
NetR354_2: 10B_WRAPPER (R354.2), 19B WLAN_CONNECTOR (R535.2 U52.1)
NetR381_2: 08 EC&SD (U1.M2), 14 EC1 PHY (R381.2)
NetR390_1: 08 EC&SD (U1.M4), 14 EC1 PHY (R390.1)
NetR391_1: 08 EC&SD (U1.L3), 14 EC1 PHY (R391.1)
NetR420_2: 16 SATA3 CONTROLLER (R420.2), 27 Clock 2 (R714.2 R715.1)
NetR421_2: 16 SATA3 CONTROLLER (R421.2), 27 Clock 2 (R716.2 R717.1)
NetR435_1: 16B Sata Connectors (R435.1), 27 Clock 2 (U64.35)
NetR441_1: 17 USB3 CONTROLLER (R441.1), 19 PCIE BRIDGE (R463.1 R479.2)
NetR442_1: 17 USB3 CONTROLLER (R442.1), 19 PCIE BRIDGE (R464.1 R478.2)
NetR465_1: 19 PCIE BRIDGE (R465.1 R481.2), 24 AUDIO CMEDIA (U61.5)
NetR466_1: 19 PCIE BRIDGE (R466.1 R480.2), 24 AUDIO CMEDIA (U61.6)
NetR576_1: 21 MXM_PCIe (R576.1 R585.2), 23 I2C WRAP (R622.2)
NetR583_2: 21 MXM_PCIe (R583.2 R584.1), 23 I2C WRAP (R621.2)
NetR615_1: 22 MXM_VIDEO_OUT (R615.1), 24 AUDIO CMEDIA (R650.1)
NetR617_1: 22 MXM_VIDEO_OUT (R617.1), 24 AUDIO CMEDIA (R651.1)
NetR633_1: 24 AUDIO CMEDIA (R633.1 R634.1), 25 AUDIO_CONN (R670.2)
NetR652_1: 24 AUDIO CMEDIA (R652.1), 25 AUDIO_CONN (R679.1)
NetR654_1: 24 AUDIO CMEDIA (R654.1), 25 AUDIO_CONN (R681.1)
NetR664_2: 24 AUDIO CMEDIA (U61.32), 25 AUDIO_CONN (R664.2 R667.1)
NetR673_2: 24 AUDIO CMEDIA (U58.31), 25 AUDIO_CONN (R673.2)
NetR682_2: 24 AUDIO CMEDIA (U58.32), 25 AUDIO_CONN (R682.2)
NetR686_2: 24 AUDIO CMEDIA (U58.28), 25 AUDIO_CONN (R686.2)
NetR703_2: 07 SYS (U1.A10), 26 Clock 1 (R703.2)
NetR705_2: 03 DDR3 (U1.E23), 26 Clock 1 (R705.2)
NetR736_2: 11 Proc Pwr1 (U1.J20), 28 Core Pwr (R736.2)
NetR737_2: 11 Proc Pwr1 (U1.K21), 28 Core Pwr (R737.2)
NetU1_A17: 04 IFC (U1.A17), 10B_WRAPPER (U32.18)
NetU1_A18: 04 IFC (U1.A18), 05 Flash (U4.19)
NetU1_B17: 04 IFC (U1.B17), 10B_WRAPPER (U32.11)
NetU1_C17: 04 IFC (U1.C17 U2.25 U2.48), 05 Flash (U4.17)
NetU1_C18: 04 IFC (U1.C18), 10B_WRAPPER (U32.14)
NetU1_D17: 04 IFC (U1.D17), 05 Flash (U3.13)
NetU1_D18: 04 IFC (U1.D18), 05 Flash (U4.18)
NetU1_D21: 04 IFC (U1.D21), 10B_WRAPPER (U32.15)
NetU1_E19: 04 IFC (U1.E19), 10B_WRAPPER (U32.13)
NetU1_F18: 04 IFC (U1.F18), 10B_WRAPPER (U32.17)
NetU1_G18: 04 IFC (U1.G18), 05 Flash (U3.34 U4.8)
NetU1_G19: 04 IFC (U1.G19), 10B_WRAPPER (U32.16)
NetU1_H5: 06 SPI&SDHC (U1.H5), 10B_WRAPPER (U32.6)
NetU1_H19: 04 IFC (U1.H19), 05 Flash (U4.16)
NetU1_K6: 06 SPI&SDHC (U1.K6), 10B_WRAPPER (U32.5)
NetU1_L6: 06 SPI&SDHC (U1.L6), 10B_WRAPPER (U32.7)
OCI1B: 17 USB3 CONTROLLER (U44.26), 18 USB3_ports (R452.1 U48.5)
OCI2B: 17 USB3 CONTROLLER (U44.24), 18 USB3_ports (R453.1 U47.5)
PCIE_PWR_ON: 10B_WRAPPER (R346.2), 19C_3G_LTE_MODEM (R541.2 R543.1 U54.5)
PPON1: 17 USB3 CONTROLLER (U44.27), 18 USB3_ports (U48.4)
PPON2: 17 USB3 CONTROLLER (U44.25), 18 USB3_ports (U47.4)
PROC_SPI_CLK: 06 SPI&SDHC (R62.2 U8.4), 10B_WRAPPER (U32.3)
PROC_SPI_MISO: 06 SPI&SDHC (U1.C2 U8.3), 10B_WRAPPER (U32.1)
PROC_SPI_MOSI: 06 SPI&SDHC (U1.C1 U8.2), 10B_WRAPPER (U32.2)
PRX_0N: 08 EC&SD (U1.AK5), 16 SATA3 CONTROLLER (U42.54)
PRX_0P: 08 EC&SD (U1.AJ5), 16 SATA3 CONTROLLER (U42.55)
PRX_1N: 08 EC&SD (U1.AJ6), 16 SATA3 CONTROLLER (U42.49)
PRX_1P: 08 EC&SD (U1.AK6), 16 SATA3 CONTROLLER (U42.50)
REFCLK2N: 19 PCIE BRIDGE (U50.G1), 27 Clock 2 (C813.2)
REFCLK2P: 19 PCIE BRIDGE (U50.G2), 27 Clock 2 (C812.2)
REFCLKIN_N: 19 PCIE BRIDGE (U50.G14), 27 Clock 2 (R706.2 R707.1)
REFCLKIN_P: 19 PCIE BRIDGE (U50.G13), 27 Clock 2 (R711.1 R712.2)
RGMII_LED_ACT: 14 EC1 PHY (M11.3), 15_ETHERNET_CONN (R415.2 R417.2)
RGMII_LINK: 14 EC1 PHY (M10.3), 15_ETHERNET_CONN (R416.2 R418.2)
RXN0: 17 USB3 CONTROLLER (C551.1), 19 PCIE BRIDGE (U50.C2)
RXN1: 19 PCIE BRIDGE (U50.E2), 24 AUDIO CMEDIA (C766.1)
RXN2: 19B WLAN_CONNECTOR (J15.43), 19 PCIE BRIDGE (U50.K2)
RXP0: 17 USB3 CONTROLLER (C550.1), 19 PCIE BRIDGE (U50.C1)
RXP1: 19 PCIE BRIDGE (U50.E1), 24 AUDIO CMEDIA (C765.1)
RXP2: 19B WLAN_CONNECTOR (J15.41), 19 PCIE BRIDGE (U50.K1)
S0_RXN: 16B Sata Connectors (TP62.1), 16 SATA3 CONTROLLER (C438.1)
S0_RXP: 16B Sata Connectors (TP63.1), 16 SATA3 CONTROLLER (C439.1)
S0_TXN: 16B Sata Connectors (TP61.1), 16 SATA3 CONTROLLER (C437.1)
S0_TXP: 16B Sata Connectors (TP60.1), 16 SATA3 CONTROLLER (C436.1)
S1_RXN: 16B Sata Connectors (C507.1), 16 SATA3 CONTROLLER (C434.1)
S1_RXP: 16B Sata Connectors (C508.1), 16 SATA3 CONTROLLER (C435.1)
S1_TXN: 16B Sata Connectors (C506.1), 16 SATA3 CONTROLLER (C433.1)
S1_TXP: 16B Sata Connectors (C505.1), 16 SATA3 CONTROLLER (C432.1)
S2_RXN: 16B Sata Connectors (TP58.1), 16 SATA3 CONTROLLER (C430.1)
S2_RXP: 16B Sata Connectors (TP59.1), 16 SATA3 CONTROLLER (C431.1)
S2_TXN: 16B Sata Connectors (TP57.1), 16 SATA3 CONTROLLER (C429.1)
S2_TXP: 16B Sata Connectors (TP56.1), 16 SATA3 CONTROLLER (C428.1)
S3_RXN: 16B Sata Connectors (C499.1), 16 SATA3 CONTROLLER (C422.1)
S3_RXP: 16B Sata Connectors (C498.1), 16 SATA3 CONTROLLER (C423.1)
S3_TXN: 16B Sata Connectors (J12.9), 16 SATA3 CONTROLLER (C421.1)
S3_TXP: 16B Sata Connectors (J12.8), 16 SATA3 CONTROLLER (C420.1)
SMBCLK: 19 PCIE BRIDGE (R514.1), 23 I2C WRAP (R624.2)
SMBDATA: 19 PCIE BRIDGE (R515.1), 23 I2C WRAP (R623.2)
TXN0: 17 USB3 CONTROLLER (R444.1), 19 PCIE BRIDGE (C575.2)
TXN1: 19 PCIE BRIDGE (C574.2), 24 AUDIO CMEDIA (U61.3)
TXN2: 19B WLAN_CONNECTOR (J15.37), 19 PCIE BRIDGE (C572.2)
TXP0: 17 USB3 CONTROLLER (R443.1), 19 PCIE BRIDGE (C573.2)
TXP1: 19 PCIE BRIDGE (C571.2), 24 AUDIO CMEDIA (U61.2)
TXP2: 19B WLAN_CONNECTOR (J15.35), 19 PCIE BRIDGE (C569.2)
TXRXM_A: 14 EC1 PHY (U38.3), 15_ETHERNET_CONN (J11.2)
TXRXM_B: 14 EC1 PHY (U38.6), 15_ETHERNET_CONN (J11.4)
TXRXM_C: 14 EC1 PHY (U38.8), 15_ETHERNET_CONN (J11.6)
TXRXM_D: 14 EC1 PHY (U38.11), 15_ETHERNET_CONN (J11.8)
TXRXP_A: 14 EC1 PHY (U38.2), 15_ETHERNET_CONN (J11.1)
TXRXP_B: 14 EC1 PHY (U38.5), 15_ETHERNET_CONN (J11.3)
TXRXP_C: 14 EC1 PHY (U38.7), 15_ETHERNET_CONN (J11.5)
TXRXP_D: 14 EC1 PHY (U38.10), 15_ETHERNET_CONN (J11.7)
USB1_DM: 09A_USB_HUB (U23.30), 09 USB (R186.2)
USB1_DP: 09A_USB_HUB (U23.31), 09 USB (R185.2)
USB2_DM: 09 USB (R188.2), 10B_WRAPPER (R300.1)
USB2_DP: 09 USB (R187.2), 10B_WRAPPER (R297.1)
WAKE_N: 10B_WRAPPER (R293.2), 16 SATA3 CONTROLLER (R423.2)